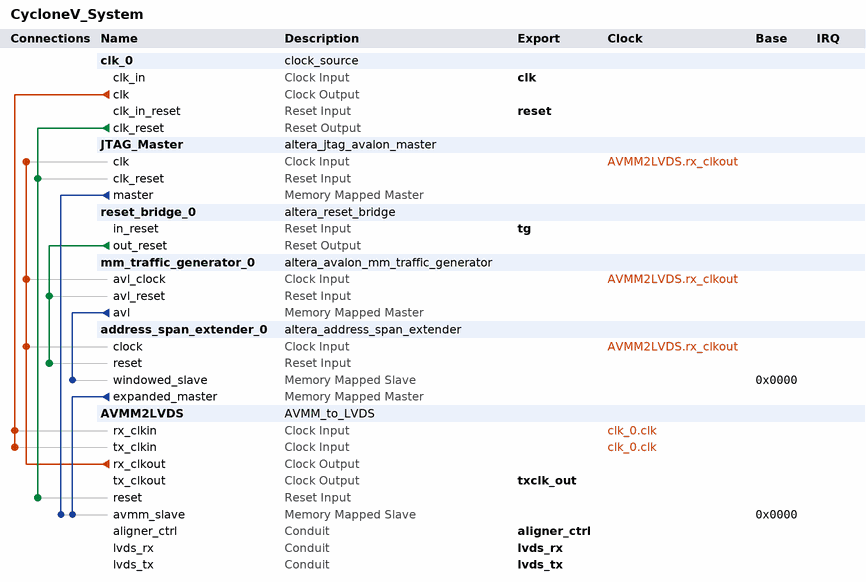
[diagram p0: system contents]
# Platform Designer (Qsys) system CycloneV_System, Cyclone V 5CSXFC6D6F31C7
# Parameters at their usual value, and those the tool derives, are not listed.
package require -exact qsys 14.1
create_system CycloneV_System
set_project_property DEVICE_FAMILY {Cyclone V}
set_project_property DEVICE 5CSXFC6D6F31C7

add_instance clk_0 clock_source 14.1
set_instance_parameter_value clk_0 clockFrequency 50000000

add_instance JTAG_Master altera_jtag_avalon_master 14.1

add_instance reset_bridge_0 altera_reset_bridge 14.1
set_instance_parameter_value reset_bridge_0 ACTIVE_LOW_RESET 1
set_instance_parameter_value reset_bridge_0 SYNCHRONOUS_EDGES none

add_instance mm_traffic_generator_0 altera_avalon_mm_traffic_generator 14.1
set_instance_parameter_value mm_traffic_generator_0 CUT_NEW_FAMILY_TIMING true
set_instance_parameter_value mm_traffic_generator_0 DISABLE_CHILD_MESSAGING false
set_instance_parameter_value mm_traffic_generator_0 ENABLE_CTRL_AVALON_INTERFACE true
set_instance_parameter_value mm_traffic_generator_0 ENABLE_EMIT_BFM_MASTER false
set_instance_parameter_value mm_traffic_generator_0 HARD_EMIF false
set_instance_parameter_value mm_traffic_generator_0 HHP_HPS false
set_instance_parameter_value mm_traffic_generator_0 HHP_HPS_SIMULATION false
set_instance_parameter_value mm_traffic_generator_0 HHP_HPS_VERIFICATION false
set_instance_parameter_value mm_traffic_generator_0 HPS_PROTOCOL DEFAULT
set_instance_parameter_value mm_traffic_generator_0 IS_ES_DEVICE false
set_instance_parameter_value mm_traffic_generator_0 PARSE_FRIENDLY_DEVICE_FAMILY_PARAM_VALID false
set_instance_parameter_value mm_traffic_generator_0 SPEED_GRADE 2
set_instance_parameter_value mm_traffic_generator_0 TG_AVL_ADDR_WIDTH_IN 12
set_instance_parameter_value mm_traffic_generator_0 TG_AVL_DATA_WIDTH_IN 8
set_instance_parameter_value mm_traffic_generator_0 TG_AVL_MAX_SIZE 1
set_instance_parameter_value mm_traffic_generator_0 TG_AVL_SYMBOL_WIDTH 8
set_instance_parameter_value mm_traffic_generator_0 TG_BLOCK_RW_BLOCK_SIZE 8
set_instance_parameter_value mm_traffic_generator_0 TG_BLOCK_RW_RAND_ADDR_COUNT 8
set_instance_parameter_value mm_traffic_generator_0 TG_BLOCK_RW_RAND_SEQ_ADDR_COUNT 8
set_instance_parameter_value mm_traffic_generator_0 TG_BLOCK_RW_SEQ_ADDR_COUNT 8
set_instance_parameter_value mm_traffic_generator_0 TG_BURST_BEGIN false
set_instance_parameter_value mm_traffic_generator_0 TG_BURST_ON_BURST_BOUNDARY false
set_instance_parameter_value mm_traffic_generator_0 TG_BYTE_ENABLE false
set_instance_parameter_value mm_traffic_generator_0 TG_DO_NOT_CROSS_4KB_BOUNDARY false
set_instance_parameter_value mm_traffic_generator_0 TG_ENABLE_DRIVER_CSR_MASTER false
set_instance_parameter_value mm_traffic_generator_0 TG_ENABLE_READ_COMPARE true
set_instance_parameter_value mm_traffic_generator_0 TG_ENABLE_UNIX_ID false
set_instance_parameter_value mm_traffic_generator_0 TG_GEN_BYTE_ADDR true
set_instance_parameter_value mm_traffic_generator_0 TG_MAX_READ_LATENCY 128
set_instance_parameter_value mm_traffic_generator_0 TG_NUM_DRIVER_LOOP 1
set_instance_parameter_value mm_traffic_generator_0 TG_PNF_ENABLE true
set_instance_parameter_value mm_traffic_generator_0 TG_POWER_OF_TWO_BURSTS_ONLY false
set_instance_parameter_value mm_traffic_generator_0 TG_POWER_OF_TWO_BUS true
set_instance_parameter_value mm_traffic_generator_0 TG_RANDOM_BYTE_ENABLE false
set_instance_parameter_value mm_traffic_generator_0 TG_RAND_ADDR_GEN_MIN_BURSTCOUNT 1
set_instance_parameter_value mm_traffic_generator_0 TG_RAND_SEQ_ADDR_GEN_MIN_BURSTCOUNT 1
set_instance_parameter_value mm_traffic_generator_0 TG_RAND_SEQ_ADDR_GEN_RAND_ADDR_PERCENT 50
set_instance_parameter_value mm_traffic_generator_0 TG_SEQ_ADDR_GEN_MIN_BURSTCOUNT 1
set_instance_parameter_value mm_traffic_generator_0 TG_SINGLE_RW_RAND_ADDR_COUNT 32
set_instance_parameter_value mm_traffic_generator_0 TG_SINGLE_RW_RAND_SEQ_ADDR_COUNT 32
set_instance_parameter_value mm_traffic_generator_0 TG_SINGLE_RW_SEQ_ADDR_COUNT 32
set_instance_parameter_value mm_traffic_generator_0 TG_SOPC_COMPAT_RESET false
set_instance_parameter_value mm_traffic_generator_0 TG_TEMPLATE_STAGE_COUNT 4
set_instance_parameter_value mm_traffic_generator_0 TG_TIMEOUT_COUNTER_WIDTH 64
set_instance_parameter_value mm_traffic_generator_0 TG_TWO_AVL_INTERFACES false
set_instance_parameter_value mm_traffic_generator_0 TG_USE_LITE_DRIVER false
set_instance_parameter_value mm_traffic_generator_0 TG_USE_UNIX_ID 0

add_instance address_span_extender_0 altera_address_span_extender 14.1
set_instance_parameter_value address_span_extender_0 BURSTCOUNT_WIDTH 3
set_instance_parameter_value address_span_extender_0 DATA_WIDTH 8
set_instance_parameter_value address_span_extender_0 MASTER_ADDRESS_DEF 0
set_instance_parameter_value address_span_extender_0 MASTER_ADDRESS_WIDTH 24
set_instance_parameter_value address_span_extender_0 MAX_PENDING_READS 4
set_instance_parameter_value address_span_extender_0 SLAVE_ADDRESS_WIDTH 12
set_instance_parameter_value address_span_extender_0 TERMINATE_SLAVE_PORT false

add_instance AVMM2LVDS AVMM_to_LVDS 1.0

# connections
add_connection AVMM2LVDS.rx_clkout address_span_extender_0.clock clock
add_connection AVMM2LVDS.rx_clkout JTAG_Master.clk clock
add_connection AVMM2LVDS.rx_clkout mm_traffic_generator_0.avl_clock clock
add_connection clk_0.clk AVMM2LVDS.rx_clkin clock
add_connection clk_0.clk AVMM2LVDS.tx_clkin clock
add_connection clk_0.clk_reset AVMM2LVDS.reset reset
add_connection clk_0.clk_reset JTAG_Master.clk_reset reset
add_connection reset_bridge_0.out_reset address_span_extender_0.reset reset
add_connection reset_bridge_0.out_reset mm_traffic_generator_0.avl_reset reset
add_connection address_span_extender_0.expanded_master AVMM2LVDS.avmm_slave avalon
set_connection_parameter_value address_span_extender_0.expanded_master/AVMM2LVDS.avmm_slave baseAddress 0x0000
add_connection JTAG_Master.master AVMM2LVDS.avmm_slave avalon
set_connection_parameter_value JTAG_Master.master/AVMM2LVDS.avmm_slave baseAddress 0x0000
add_connection mm_traffic_generator_0.avl address_span_extender_0.windowed_slave avalon
set_connection_parameter_value mm_traffic_generator_0.avl/address_span_extender_0.windowed_slave baseAddress 0x0000

# exported interfaces
add_interface aligner_ctrl conduit end
set_interface_property aligner_ctrl EXPORT_OF AVMM2LVDS.aligner_ctrl
add_interface clk clock sink
set_interface_property clk EXPORT_OF clk_0.clk_in
add_interface lvds_rx conduit end
set_interface_property lvds_rx EXPORT_OF AVMM2LVDS.lvds_rx
add_interface lvds_tx conduit end
set_interface_property lvds_tx EXPORT_OF AVMM2LVDS.lvds_tx
add_interface reset reset sink
set_interface_property reset EXPORT_OF clk_0.clk_in_reset
add_interface tg reset sink
set_interface_property tg EXPORT_OF reset_bridge_0.in_reset
add_interface txclk_out clock source
set_interface_property txclk_out EXPORT_OF AVMM2LVDS.tx_clkout

set_interconnect_requirement {$system} qsys_mm.clockCrossingAdapter HANDSHAKE
set_interconnect_requirement {$system} qsys_mm.insertDefaultSlave FALSE
set_interconnect_requirement {$system} qsys_mm.maxAdditionalLatency 1

save_system CycloneV_System.qsys
